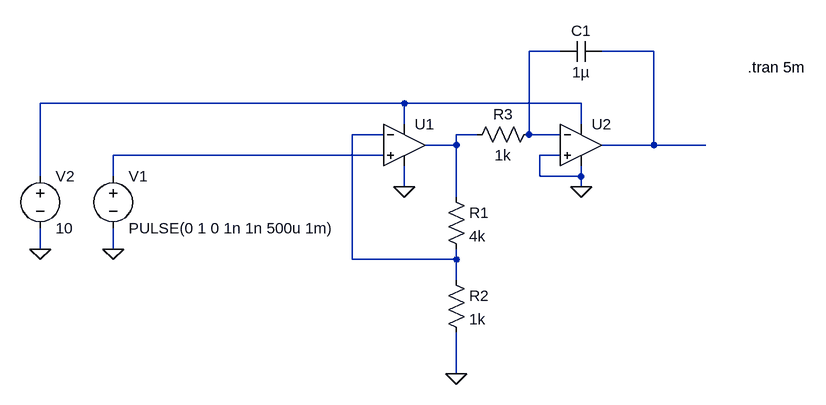
[diagram p0: schematic Signal genrator.asc]
Signal genrator.asc, the LTspice schematic file:
Version 4
SHEET 1 1152 680
WIRE 768 16 720 16
WIRE 912 16 832 16
WIRE 528 96 -32 96
WIRE 800 96 528 96
WIRE 528 128 528 96
WIRE 800 128 800 96
WIRE 496 144 448 144
WIRE 640 144 608 144
WIRE 720 144 720 16
WIRE 768 144 720 144
WIRE 608 160 608 144
WIRE 608 160 560 160
WIRE 912 160 912 16
WIRE 912 160 832 160
WIRE 992 160 912 160
WIRE 496 176 80 176
WIRE 768 176 736 176
WIRE -32 208 -32 96
WIRE 80 208 80 176
WIRE 736 208 736 176
WIRE 800 208 800 192
WIRE 800 208 736 208
WIRE 528 224 528 192
WIRE 800 224 800 208
WIRE 608 240 608 160
WIRE -32 320 -32 288
WIRE 80 320 80 288
WIRE 448 336 448 144
WIRE 608 336 608 320
WIRE 608 336 448 336
WIRE 608 368 608 336
WIRE 608 512 608 448
FLAG 80 320 0
FLAG -32 320 0
FLAG 608 512 0
FLAG 528 224 0
FLAG 800 224 0
SYMBOL Voltage 80 192 R0
SYMATTR InstName V1
SYMATTR Value PULSE(0 1 0 1n 1n 500u 1m)
SYMBOL Voltage -32 192 R0
SYMATTR InstName V2
SYMATTR Value 10
SYMBOL OpAmps/UniversalOpAmp 528 160 R0
SYMATTR InstName U1
SYMBOL OpAmps/UniversalOpAmp 800 160 R0
SYMATTR InstName U2
SYMBOL Res 592 224 R0
SYMATTR InstName R1
SYMATTR Value 4k
SYMBOL Res 592 352 R0
SYMATTR InstName R2
SYMATTR Value 1k
SYMBOL Cap 832 0 R90
WINDOW 0 0 32 VBottom 2
WINDOW 3 32 32 VTop 2
SYMATTR InstName C1
SYMATTR Value 1µ
SYMBOL Res 736 128 R90
WINDOW 0 0 56 VBottom 2
WINDOW 3 32 56 VTop 2
SYMATTR InstName R3
SYMATTR Value 1k
TEXT 1056 40 Left 2 !.tran 5m

The netlist it stands for:
* Signal genrator.asc
V1 N006 0 PULSE(0 1 0 1n 1n 500u 1m)
V2 N003 0 10
XU1 N006 N004 N003 0 N005 level1 Avol=1Meg GBW=10Meg Vos=0 En=0 Enk=0 In=0 Ink=0 Rin=500Meg  ; pins In+ In- V+ V- OUT
XU2 0 N001 N003 0 N002 level1 Avol=1Meg GBW=10Meg Vos=0 En=0 Enk=0 In=0 Ink=0 Rin=500Meg  ; pins In+ In- V+ V- OUT
R1 N005 N004 4k
R2 N004 0 1k
C1 N002 N001 1µ
R3 N001 N005 1k
.tran 5m
.lib UniversalOpAmp1.lib
.backanno
.end